# EasyEDA schematic SCH_BOB Drivers_4x_2022-07-10.json
TITLE: Sheet_1; REV: 1.0; Date: 2022-06-11; Sheet: 1/1; Drawn By: Edward Niedziejko; Company: Your Company
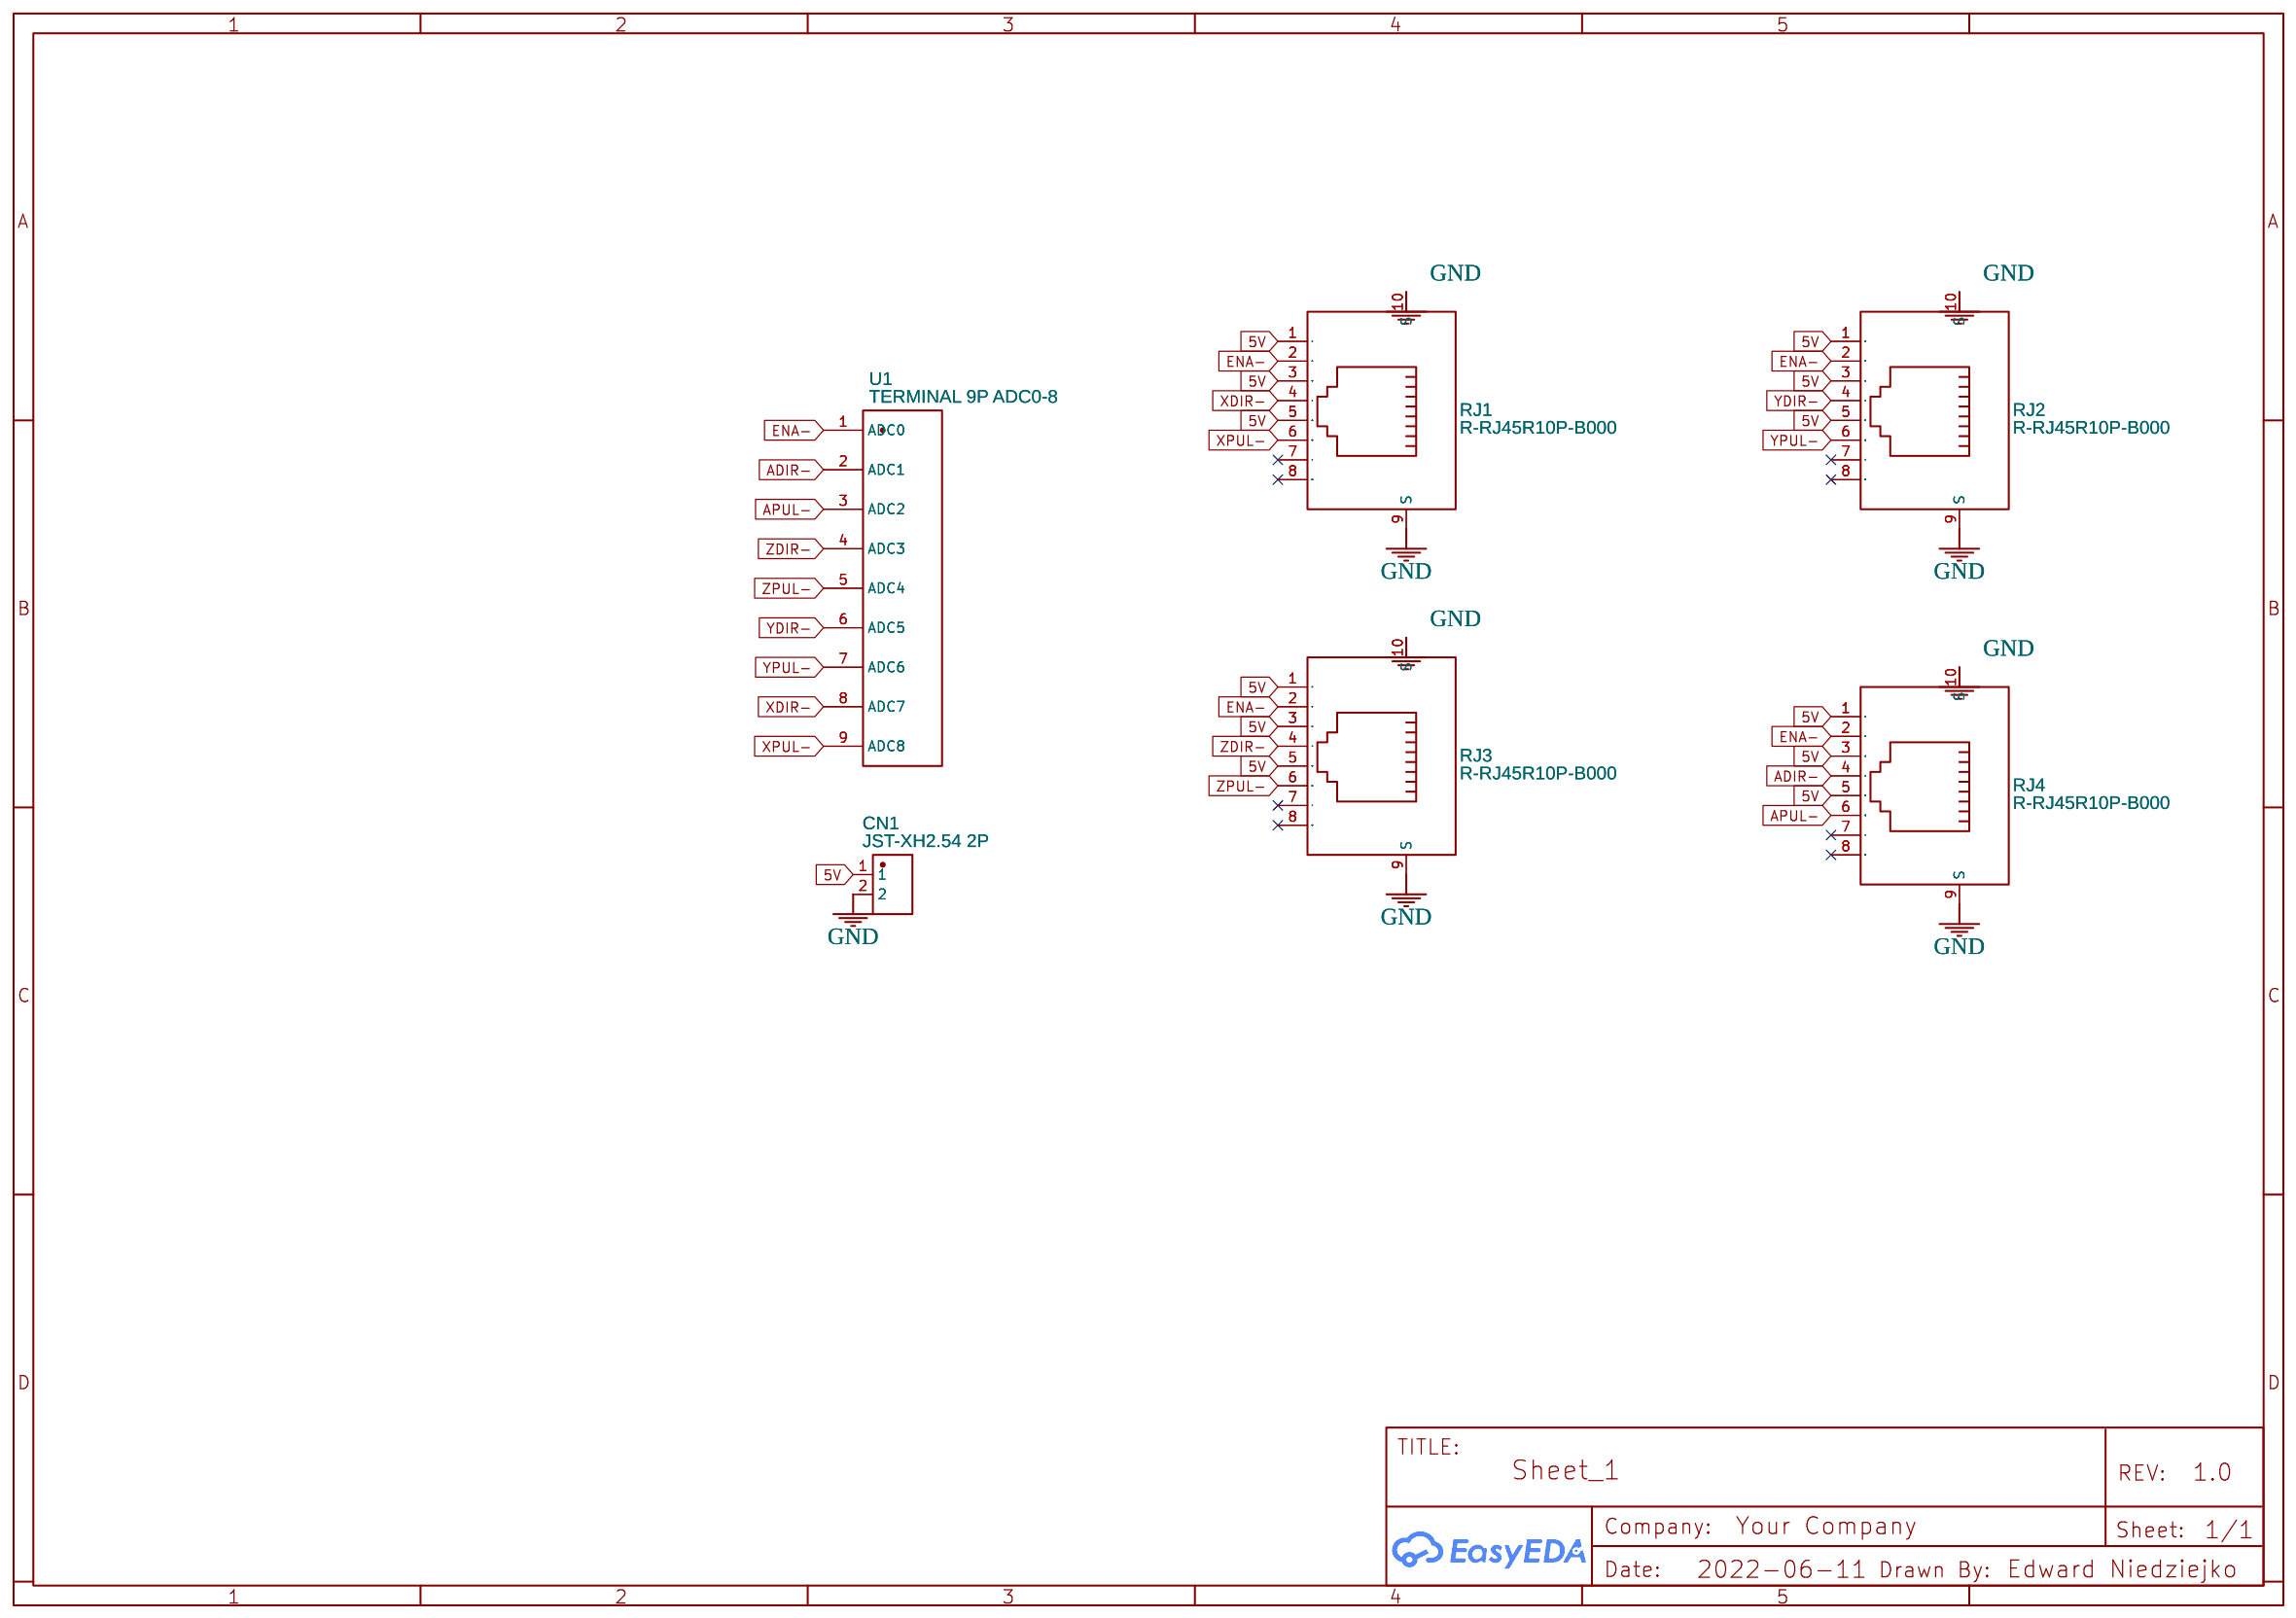
[diagram p0: schematic sheet]

## Parts
CN1  JST-XH2.54 2P  [JST-XH2.54 2P]
RJ1  R-RJ45R10P-B000  [RJ45-TH_R-RJ45R10P-B000]
RJ2  R-RJ45R10P-B000  [RJ45-TH_R-RJ45R10P-B000]
RJ3  R-RJ45R10P-B000  [RJ45-TH_R-RJ45R10P-B000]
RJ4  R-RJ45R10P-B000  [RJ45-TH_R-RJ45R10P-B000]
U1  TERMINAL 9P ADC0-8  [TERMINAL_5.00_9P_ADC0-8]

## Library data of the parts
CN1 = JST-XH2.54 2P: Supplier: CQRobot; link: https://www.amazon.fr/dp/B01EQGNZ2I/?coliid=IQPWZUUK7M1P0&colid=2CFFEVMK4YZ12&ref_=lv_ov_lig_dp_it_im&th=1; Contributor: marierigal4
RJ1-RJ4 = R-RJ45R10P-B000: Supplier: LCSC; Supplier Part: C386758; Manufacturer: Shenzhen Cankemeng; Contributor: LCSC; JLCPCB Part Class: Extended Part
U1 = TERMINAL 9P ADC0-8: Supplier Part: KF-301-3P; Supplier: shopee; Contributor: astronomer6573

## Nets
5V: CN1.1 RJ1.1 RJ1.3 RJ1.5 RJ2.1 RJ2.3 RJ2.5 RJ3.1 RJ3.3 RJ3.5 RJ4.1 RJ4.3 RJ4.5
GND: CN1.2 RJ1.9(S) RJ1.10(S) RJ2.9(S) RJ2.10(S) RJ3.9(S) RJ3.10(S) RJ4.9(S) RJ4.10(S)
ADIR-: RJ4.4 U1.2(ADC1)
APUL-: RJ4.6 U1.3(ADC2)
ENA-: RJ1.2 RJ2.2 RJ3.2 RJ4.2 U1.1(ADC0)
XDIR-: RJ1.4 U1.8(ADC7)
XPUL-: RJ1.6 U1.9(ADC8)
YDIR-: RJ2.4 U1.6(ADC5)
YPUL-: RJ2.6 U1.7(ADC6)
ZDIR-: RJ3.4 U1.4(ADC3)
ZPUL-: RJ3.6 U1.5(ADC4)

Not connected (* = marked no-connect by the designer): RJ1 7* 8*; RJ2 7* 8*; RJ3 7* 8*; RJ4 7* 8*
